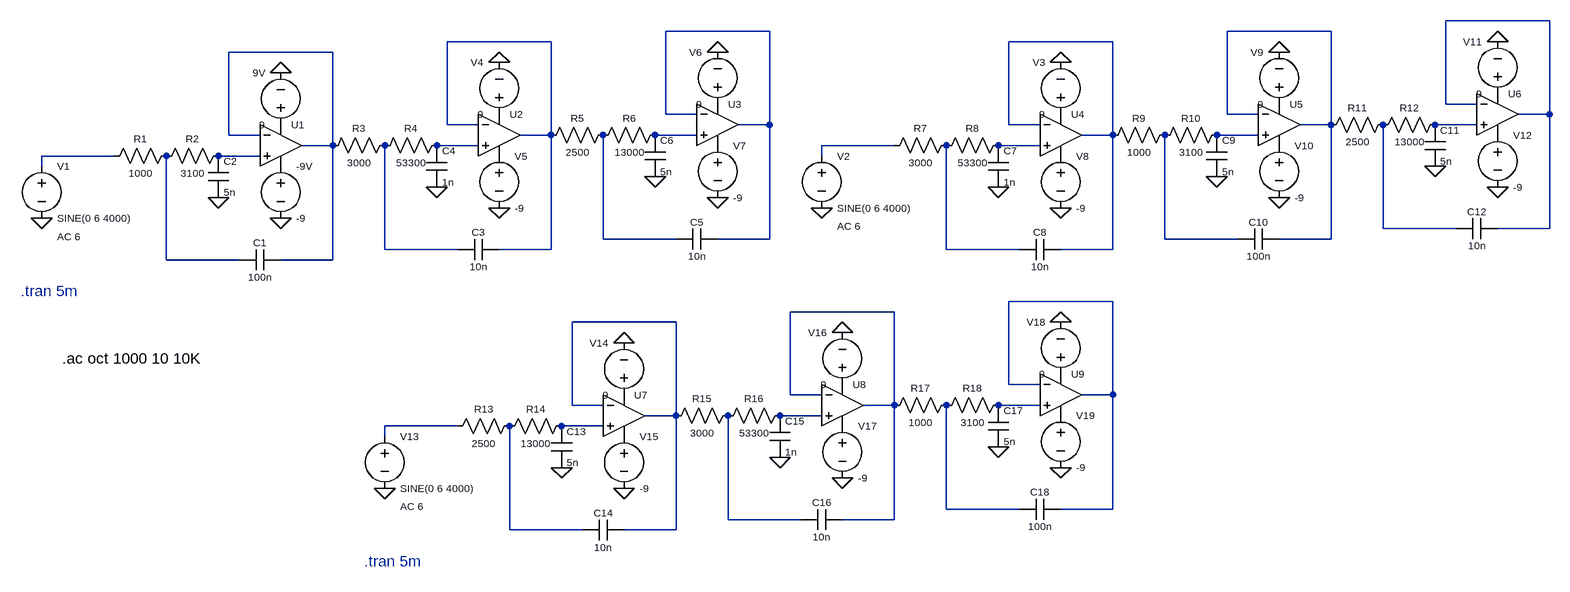
[diagram p0: schematic Low Pass Filter.asc]
Low Pass Filter.asc, the LTspice schematic file:
Version 4
SHEET 1 2344 1520
WIRE 2336 672 2176 672
WIRE 1136 688 976 688
WIRE 2000 688 1840 688
WIRE 800 704 640 704
WIRE 1664 704 1504 704
WIRE 464 720 304 720
WIRE 2176 800 2176 672
WIRE 2224 800 2176 800
WIRE 976 816 976 688
WIRE 1024 816 976 816
WIRE 1840 816 1840 688
WIRE 1888 816 1840 816
WIRE 2336 816 2336 672
WIRE 2336 816 2288 816
WIRE 640 832 640 704
WIRE 688 832 640 832
WIRE 1136 832 1136 688
WIRE 1136 832 1088 832
WIRE 1504 832 1504 704
WIRE 1552 832 1504 832
WIRE 2000 832 2000 688
WIRE 2000 832 1952 832
WIRE 2224 832 2160 832
WIRE 304 848 304 720
WIRE 352 848 304 848
WIRE 800 848 800 704
WIRE 800 848 752 848
WIRE 1024 848 960 848
WIRE 1664 848 1664 704
WIRE 1664 848 1616 848
WIRE 1888 848 1824 848
WIRE 464 864 464 720
WIRE 464 864 416 864
WIRE 688 864 624 864
WIRE 1328 864 1216 864
WIRE 1552 864 1488 864
WIRE 128 880 16 880
WIRE 352 880 288 880
WIRE 1216 880 1216 864
WIRE 16 896 16 880
WIRE 2080 992 2080 832
WIRE 2192 992 2080 992
WIRE 2336 992 2336 816
WIRE 2336 992 2256 992
WIRE 880 1008 880 848
WIRE 992 1008 880 1008
WIRE 1136 1008 1136 832
WIRE 1136 1008 1056 1008
WIRE 1744 1008 1744 848
WIRE 1856 1008 1744 1008
WIRE 2000 1008 2000 832
WIRE 2000 1008 1920 1008
WIRE 544 1024 544 864
WIRE 656 1024 544 1024
WIRE 800 1024 800 848
WIRE 800 1024 720 1024
WIRE 1408 1024 1408 864
WIRE 1520 1024 1408 1024
WIRE 1664 1024 1664 848
WIRE 1664 1024 1584 1024
WIRE 208 1040 208 880
WIRE 320 1040 208 1040
WIRE 464 1040 464 864
WIRE 464 1040 384 1040
WIRE 1664 1104 1504 1104
WIRE 1328 1120 1168 1120
WIRE 992 1136 832 1136
WIRE 1504 1232 1504 1104
WIRE 1552 1232 1504 1232
WIRE 1168 1248 1168 1120
WIRE 1216 1248 1168 1248
WIRE 1664 1248 1664 1104
WIRE 1664 1248 1616 1248
WIRE 832 1264 832 1136
WIRE 880 1264 832 1264
WIRE 1328 1264 1328 1120
WIRE 1328 1264 1280 1264
WIRE 1552 1264 1488 1264
WIRE 992 1280 992 1136
WIRE 992 1280 944 1280
WIRE 1216 1280 1152 1280
WIRE 656 1296 544 1296
WIRE 880 1296 816 1296
WIRE 544 1312 544 1296
WIRE 1408 1424 1408 1264
WIRE 1520 1424 1408 1424
WIRE 1664 1424 1664 1248
WIRE 1664 1424 1584 1424
WIRE 1072 1440 1072 1280
WIRE 1184 1440 1072 1440
WIRE 1328 1440 1328 1264
WIRE 1328 1440 1248 1440
WIRE 736 1456 736 1296
WIRE 848 1456 736 1456
WIRE 992 1456 992 1280
WIRE 992 1456 912 1456
FLAG 16 976 0
FLAG 288 944 0
FLAG 384 976 0
FLAG 384 752 0
FLAG 624 928 0
FLAG 720 960 0
FLAG 720 736 0
FLAG 960 912 0
FLAG 1056 944 0
FLAG 1056 720 0
FLAG 1216 960 0
FLAG 1488 928 0
FLAG 1584 960 0
FLAG 1584 736 0
FLAG 1824 912 0
FLAG 1920 944 0
FLAG 1920 720 0
FLAG 2160 896 0
FLAG 2256 928 0
FLAG 2256 704 0
FLAG 544 1392 0
FLAG 816 1360 0
FLAG 912 1392 0
FLAG 912 1168 0
FLAG 1152 1344 0
FLAG 1248 1376 0
FLAG 1248 1152 0
FLAG 1488 1328 0
FLAG 1584 1360 0
FLAG 1584 1136 0
SYMBOL OpAmps\\UniversalOpAmp 384 864 R0
WINDOW 0 16 -32 Left 1
SYMATTR InstName U1
SYMBOL res 224 864 R90
WINDOW 0 0 56 VBottom 1
WINDOW 3 32 56 VTop 1
SYMATTR InstName R1
SYMATTR Value 1000
SYMBOL res 304 864 R90
WINDOW 0 0 56 VBottom 1
WINDOW 3 32 56 VTop 1
SYMATTR InstName R2
SYMATTR Value 3100
SYMATTR SpiceLine tol=1 pwr=0.1
SYMBOL cap 272 880 R0
WINDOW 0 24 8 Left 1
WINDOW 3 24 56 Left 1
SYMATTR InstName C2
SYMATTR Value 5n
SYMBOL cap 384 1024 R90
WINDOW 0 0 32 VBottom 1
WINDOW 3 32 32 VTop 1
SYMATTR InstName C1
SYMATTR Value 100n
SYMBOL voltage 16 880 R0
WINDOW 0 24 16 Left 1
WINDOW 3 24 96 Left 1
WINDOW 123 24 124 Left 1
WINDOW 39 0 0 Left 0
SYMATTR InstName V1
SYMATTR Value SINE(0 6 4000)
SYMATTR Value2 AC 6
SYMBOL voltage 384 848 R180
WINDOW 0 24 96 Left 1
WINDOW 3 24 16 Left 1
WINDOW 123 0 0 Left 0
WINDOW 39 0 0 Left 0
SYMATTR InstName 9V
SYMATTR Value 9
SYMBOL voltage 384 880 R0
WINDOW 123 0 0 Left 0
WINDOW 39 0 0 Left 0
WINDOW 0 24 16 Left 1
WINDOW 3 24 96 Left 1
SYMATTR InstName -9V
SYMATTR Value -9
SYMBOL OpAmps\\UniversalOpAmp 720 848 R0
WINDOW 0 16 -32 Left 1
SYMATTR InstName U2
SYMBOL res 560 848 R90
WINDOW 0 0 56 VBottom 1
WINDOW 3 32 56 VTop 1
SYMATTR InstName R3
SYMATTR Value 3000
SYMBOL res 640 848 R90
WINDOW 0 0 56 VBottom 1
WINDOW 3 32 56 VTop 1
SYMATTR InstName R4
SYMATTR Value 53300
SYMATTR SpiceLine tol=1 pwr=0.1
SYMBOL cap 608 864 R0
WINDOW 0 24 8 Left 1
WINDOW 3 24 56 Left 1
SYMATTR InstName C4
SYMATTR Value 1n
SYMBOL cap 720 1008 R90
WINDOW 0 0 32 VBottom 1
WINDOW 3 32 32 VTop 1
SYMATTR InstName C3
SYMATTR Value 10n
SYMBOL voltage 720 832 R180
WINDOW 0 24 96 Left 1
WINDOW 3 24 16 Left 1
WINDOW 123 0 0 Left 0
WINDOW 39 0 0 Left 0
SYMATTR InstName V4
SYMATTR Value 9
SYMBOL voltage 720 864 R0
WINDOW 123 0 0 Left 0
WINDOW 39 0 0 Left 0
WINDOW 0 24 16 Left 1
WINDOW 3 24 96 Left 1
SYMATTR InstName V5
SYMATTR Value -9
SYMBOL OpAmps\\UniversalOpAmp 1056 832 R0
WINDOW 0 16 -32 Left 1
SYMATTR InstName U3
SYMBOL res 896 832 R90
WINDOW 0 0 56 VBottom 1
WINDOW 3 32 56 VTop 1
SYMATTR InstName R5
SYMATTR Value 2500
SYMBOL res 976 832 R90
WINDOW 0 0 56 VBottom 1
WINDOW 3 32 56 VTop 1
SYMATTR InstName R6
SYMATTR Value 13000
SYMATTR SpiceLine tol=1 pwr=0.1
SYMBOL cap 944 848 R0
WINDOW 0 24 8 Left 1
WINDOW 3 24 56 Left 1
SYMATTR InstName C6
SYMATTR Value 5n
SYMBOL cap 1056 992 R90
WINDOW 0 0 32 VBottom 1
WINDOW 3 32 32 VTop 1
SYMATTR InstName C5
SYMATTR Value 10n
SYMBOL voltage 1056 816 R180
WINDOW 0 24 96 Left 1
WINDOW 3 24 16 Left 1
WINDOW 123 0 0 Left 0
WINDOW 39 0 0 Left 0
SYMATTR InstName V6
SYMATTR Value 9
SYMBOL voltage 1056 848 R0
WINDOW 123 0 0 Left 0
WINDOW 39 0 0 Left 0
WINDOW 0 24 16 Left 1
WINDOW 3 24 96 Left 1
SYMATTR InstName V7
SYMATTR Value -9
SYMBOL OpAmps\\UniversalOpAmp 1584 848 R0
WINDOW 0 16 -32 Left 1
SYMATTR InstName U4
SYMBOL res 1424 848 R90
WINDOW 0 0 56 VBottom 1
WINDOW 3 32 56 VTop 1
SYMATTR InstName R7
SYMATTR Value 3000
SYMBOL res 1504 848 R90
WINDOW 0 0 56 VBottom 1
WINDOW 3 32 56 VTop 1
SYMATTR InstName R8
SYMATTR Value 53300
SYMATTR SpiceLine tol=1 pwr=0.1
SYMBOL cap 1472 864 R0
WINDOW 0 24 8 Left 1
WINDOW 3 24 56 Left 1
SYMATTR InstName C7
SYMATTR Value 1n
SYMBOL cap 1584 1008 R90
WINDOW 0 0 32 VBottom 1
WINDOW 3 32 32 VTop 1
SYMATTR InstName C8
SYMATTR Value 10n
SYMBOL voltage 1216 864 R0
WINDOW 0 24 16 Left 1
WINDOW 3 24 96 Left 1
WINDOW 123 24 124 Left 1
WINDOW 39 0 0 Left 0
SYMATTR InstName V2
SYMATTR Value SINE(0 6 4000)
SYMATTR Value2 AC 6
SYMBOL voltage 1584 832 R180
WINDOW 0 24 96 Left 1
WINDOW 3 24 16 Left 1
WINDOW 123 0 0 Left 0
WINDOW 39 0 0 Left 0
SYMATTR InstName V3
SYMATTR Value 9
SYMBOL voltage 1584 864 R0
WINDOW 123 0 0 Left 0
WINDOW 39 0 0 Left 0
WINDOW 0 24 16 Left 1
WINDOW 3 24 96 Left 1
SYMATTR InstName V8
SYMATTR Value -9
SYMBOL OpAmps\\UniversalOpAmp 1920 832 R0
WINDOW 0 16 -32 Left 1
SYMATTR InstName U5
SYMBOL res 1760 832 R90
WINDOW 0 0 56 VBottom 1
WINDOW 3 32 56 VTop 1
SYMATTR InstName R9
SYMATTR Value 1000
SYMBOL res 1840 832 R90
WINDOW 0 0 56 VBottom 1
WINDOW 3 32 56 VTop 1
SYMATTR InstName R10
SYMATTR Value 3100
SYMATTR SpiceLine tol=1 pwr=0.1
SYMBOL cap 1808 848 R0
WINDOW 0 24 8 Left 1
WINDOW 3 24 56 Left 1
SYMATTR InstName C9
SYMATTR Value 5n
SYMBOL cap 1920 992 R90
WINDOW 0 0 32 VBottom 1
WINDOW 3 32 32 VTop 1
SYMATTR InstName C10
SYMATTR Value 100n
SYMBOL voltage 1920 816 R180
WINDOW 0 24 96 Left 1
WINDOW 3 24 16 Left 1
WINDOW 123 0 0 Left 0
WINDOW 39 0 0 Left 0
SYMATTR InstName V9
SYMATTR Value 9
SYMBOL voltage 1920 848 R0
WINDOW 123 0 0 Left 0
WINDOW 39 0 0 Left 0
WINDOW 0 24 16 Left 1
WINDOW 3 24 96 Left 1
SYMATTR InstName V10
SYMATTR Value -9
SYMBOL OpAmps\\UniversalOpAmp 2256 816 R0
WINDOW 0 16 -32 Left 1
SYMATTR InstName U6
SYMBOL res 2096 816 R90
WINDOW 0 0 56 VBottom 1
WINDOW 3 32 56 VTop 1
SYMATTR InstName R11
SYMATTR Value 2500
SYMBOL res 2176 816 R90
WINDOW 0 0 56 VBottom 1
WINDOW 3 32 56 VTop 1
SYMATTR InstName R12
SYMATTR Value 13000
SYMATTR SpiceLine tol=1 pwr=0.1
SYMBOL cap 2144 832 R0
WINDOW 0 24 8 Left 1
WINDOW 3 24 56 Left 1
SYMATTR InstName C11
SYMATTR Value 5n
SYMBOL cap 2256 976 R90
WINDOW 0 0 32 VBottom 1
WINDOW 3 32 32 VTop 1
SYMATTR InstName C12
SYMATTR Value 10n
SYMBOL voltage 2256 800 R180
WINDOW 0 24 96 Left 1
WINDOW 3 24 16 Left 1
WINDOW 123 0 0 Left 0
WINDOW 39 0 0 Left 0
SYMATTR InstName V11
SYMATTR Value 9
SYMBOL voltage 2256 832 R0
WINDOW 123 0 0 Left 0
WINDOW 39 0 0 Left 0
WINDOW 0 24 16 Left 1
WINDOW 3 24 96 Left 1
SYMATTR InstName V12
SYMATTR Value -9
SYMBOL OpAmps\\UniversalOpAmp 912 1280 R0
WINDOW 0 16 -32 Left 1
SYMATTR InstName U7
SYMBOL res 752 1280 R90
WINDOW 0 0 56 VBottom 1
WINDOW 3 32 56 VTop 1
SYMATTR InstName R13
SYMATTR Value 2500
SYMBOL res 832 1280 R90
WINDOW 0 0 56 VBottom 1
WINDOW 3 32 56 VTop 1
SYMATTR InstName R14
SYMATTR Value 13000
SYMATTR SpiceLine tol=1 pwr=0.1
SYMBOL cap 800 1296 R0
WINDOW 0 24 8 Left 1
WINDOW 3 24 56 Left 1
SYMATTR InstName C13
SYMATTR Value 5n
SYMBOL cap 912 1440 R90
WINDOW 0 0 32 VBottom 1
WINDOW 3 32 32 VTop 1
SYMATTR InstName C14
SYMATTR Value 10n
SYMBOL voltage 544 1296 R0
WINDOW 0 24 16 Left 1
WINDOW 3 24 96 Left 1
WINDOW 123 24 124 Left 1
WINDOW 39 0 0 Left 0
SYMATTR InstName V13
SYMATTR Value SINE(0 6 4000)
SYMATTR Value2 AC 6
SYMBOL voltage 912 1264 R180
WINDOW 0 24 96 Left 1
WINDOW 3 24 16 Left 1
WINDOW 123 0 0 Left 0
WINDOW 39 0 0 Left 0
SYMATTR InstName V14
SYMATTR Value 9
SYMBOL voltage 912 1296 R0
WINDOW 123 0 0 Left 0
WINDOW 39 0 0 Left 0
WINDOW 0 24 16 Left 1
WINDOW 3 24 96 Left 1
SYMATTR InstName V15
SYMATTR Value -9
SYMBOL OpAmps\\UniversalOpAmp 1248 1264 R0
WINDOW 0 16 -32 Left 1
SYMATTR InstName U8
SYMBOL res 1088 1264 R90
WINDOW 0 0 56 VBottom 1
WINDOW 3 32 56 VTop 1
SYMATTR InstName R15
SYMATTR Value 3000
SYMBOL res 1168 1264 R90
WINDOW 0 0 56 VBottom 1
WINDOW 3 32 56 VTop 1
SYMATTR InstName R16
SYMATTR Value 53300
SYMATTR SpiceLine tol=1 pwr=0.1
SYMBOL cap 1136 1280 R0
WINDOW 0 24 8 Left 1
WINDOW 3 24 56 Left 1
SYMATTR InstName C15
SYMATTR Value 1n
SYMBOL cap 1248 1424 R90
WINDOW 0 0 32 VBottom 1
WINDOW 3 32 32 VTop 1
SYMATTR InstName C16
SYMATTR Value 10n
SYMBOL voltage 1248 1248 R180
WINDOW 0 24 96 Left 1
WINDOW 3 24 16 Left 1
WINDOW 123 0 0 Left 0
WINDOW 39 0 0 Left 0
SYMATTR InstName V16
SYMATTR Value 9
SYMBOL voltage 1248 1280 R0
WINDOW 123 0 0 Left 0
WINDOW 39 0 0 Left 0
WINDOW 0 24 16 Left 1
WINDOW 3 24 96 Left 1
SYMATTR InstName V17
SYMATTR Value -9
SYMBOL OpAmps\\UniversalOpAmp 1584 1248 R0
WINDOW 0 16 -32 Left 1
SYMATTR InstName U9
SYMBOL res 1424 1248 R90
WINDOW 0 0 56 VBottom 1
WINDOW 3 32 56 VTop 1
SYMATTR InstName R17
SYMATTR Value 1000
SYMBOL res 1504 1248 R90
WINDOW 0 0 56 VBottom 1
WINDOW 3 32 56 VTop 1
SYMATTR InstName R18
SYMATTR Value 3100
SYMATTR SpiceLine tol=1 pwr=0.1
SYMBOL cap 1472 1264 R0
WINDOW 0 24 8 Left 1
WINDOW 3 24 56 Left 1
SYMATTR InstName C17
SYMATTR Value 5n
SYMBOL cap 1584 1408 R90
WINDOW 0 0 32 VBottom 1
WINDOW 3 32 32 VTop 1
SYMATTR InstName C18
SYMATTR Value 100n
SYMBOL voltage 1584 1232 R180
WINDOW 0 24 96 Left 1
WINDOW 3 24 16 Left 1
WINDOW 123 0 0 Left 0
WINDOW 39 0 0 Left 0
SYMATTR InstName V18
SYMATTR Value 9
SYMBOL voltage 1584 1264 R0
WINDOW 123 0 0 Left 0
WINDOW 39 0 0 Left 0
WINDOW 0 24 16 Left 1
WINDOW 3 24 96 Left 1
SYMATTR InstName V19
SYMATTR Value -9
TEXT -16 1088 Left 2 ;.tran 5m
TEXT 48 1192 Left 2 !.ac oct 1000 10 10K
TEXT 512 1504 Left 2 ;.tran 5m

The netlist it stands for:
* Low Pass Filter.asc
XU1 N014 N006 P001 P002 N006 level1 Avol=1Meg GBW=10Meg Vos=0 En=0 Enk=0 In=0 Ink=0 Rin=500Meg  ; pins In+ In- V+ V- OUT
R1 N020 N013 1000
R2 N014 N020 3100 tol=1 pwr=0.1
C2 N014 0 5n
C1 N006 N020 100n
V1 N013 0 SINE(0 6 4000) AC 6
V§9V P001 0 9
V§-9V P002 0 -9
XU2 N010 N004 P003 P004 N004 level1 Avol=1Meg GBW=10Meg Vos=0 En=0 Enk=0 In=0 Ink=0 Rin=500Meg  ; pins In+ In- V+ V- OUT
R3 N018 N006 3000
R4 N010 N018 53300 tol=1 pwr=0.1
C4 N010 0 1n
C3 N004 N018 10n
V4 P003 0 9
V5 P004 0 -9
XU3 N008 N002 P005 P006 N002 level1 Avol=1Meg GBW=10Meg Vos=0 En=0 Enk=0 In=0 Ink=0 Rin=500Meg  ; pins In+ In- V+ V- OUT
R5 N016 N004 2500
R6 N008 N016 13000 tol=1 pwr=0.1
C6 N008 0 5n
C5 N002 N016 10n
V6 P005 0 9
V7 P006 0 -9
XU4 N012 N005 P007 P008 N005 level1 Avol=1Meg GBW=10Meg Vos=0 En=0 Enk=0 In=0 Ink=0 Rin=500Meg  ; pins In+ In- V+ V- OUT
R7 N019 N011 3000
R8 N012 N019 53300 tol=1 pwr=0.1
C7 N012 0 1n
C8 N005 N019 10n
V2 N011 0 SINE(0 6 4000) AC 6
V3 P007 0 9
V8 P008 0 -9
XU5 N009 N003 P009 P010 N003 level1 Avol=1Meg GBW=10Meg Vos=0 En=0 Enk=0 In=0 Ink=0 Rin=500Meg  ; pins In+ In- V+ V- OUT
R9 N017 N005 1000
R10 N009 N017 3100 tol=1 pwr=0.1
C9 N009 0 5n
C10 N003 N017 100n
V9 P009 0 9
V10 P010 0 -9
XU6 N007 N001 P011 P012 N001 level1 Avol=1Meg GBW=10Meg Vos=0 En=0 Enk=0 In=0 Ink=0 Rin=500Meg  ; pins In+ In- V+ V- OUT
R11 N015 N003 2500
R12 N007 N015 13000 tol=1 pwr=0.1
C11 N007 0 5n
C12 N001 N015 10n
V11 P011 0 9
V12 P012 0 -9
XU7 N027 N023 P013 P014 N023 level1 Avol=1Meg GBW=10Meg Vos=0 En=0 Enk=0 In=0 Ink=0 Rin=500Meg  ; pins In+ In- V+ V- OUT
R13 N030 N026 2500
R14 N027 N030 13000 tol=1 pwr=0.1
C13 N027 0 5n
C14 N023 N030 10n
V13 N026 0 SINE(0 6 4000) AC 6
V14 P013 0 9
V15 P014 0 -9
XU8 N025 N022 P015 P016 N022 level1 Avol=1Meg GBW=10Meg Vos=0 En=0 Enk=0 In=0 Ink=0 Rin=500Meg  ; pins In+ In- V+ V- OUT
R15 N029 N023 3000
R16 N025 N029 53300 tol=1 pwr=0.1
C15 N025 0 1n
C16 N022 N029 10n
V16 P015 0 9
V17 P016 0 -9
XU9 N024 N021 P017 P018 N021 level1 Avol=1Meg GBW=10Meg Vos=0 En=0 Enk=0 In=0 Ink=0 Rin=500Meg  ; pins In+ In- V+ V- OUT
R17 N028 N022 1000
R18 N024 N028 3100 tol=1 pwr=0.1
C17 N024 0 5n
C18 N021 N028 100n
V18 P017 0 9
V19 P018 0 -9
* .tran 5m
.ac oct 1000 10 10K
* .tran 5m
.lib UniversalOpAmp1.lib
.backanno
.end